# Altium schematic sheet 07-NET.SchDoc
size A4
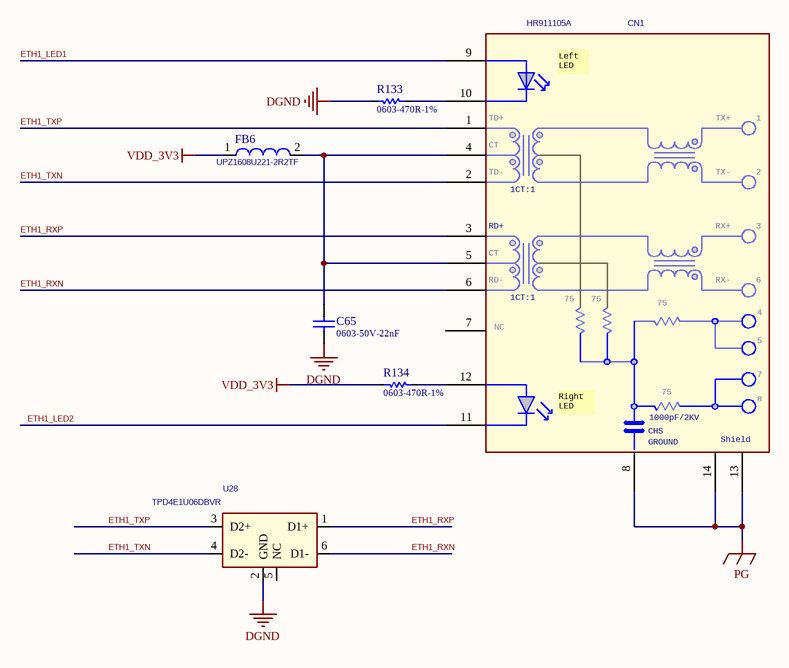
[diagram p0: 07-NET.SchDoc]

## Parts
C65  0603-50V-22nF  [0603C]
CN1  HR911105A  [HY911105A]
FB6  UPZ1608U221-2R2TF  [0603L]
R133  0603-470R-1%  [0603R]
R134  0603-470R-1%  [0603R]
U28  TPD4E1U06DBVR  [LC-SOT-23-6]

## Nets
DGND: C65.2 R133.1 U28.2(GND)
PG: CN1.8(P8) CN1.13(S1) CN1.14(S2)
VDD_3V3: FB6.1 R134.1
ETH1_LED1: CN1.9(LLED+)
ETH1_LED2: CN1.11(RLED-)
ETH1_RXN: CN1.6(P6) U28.6(D1-)
ETH1_RXP: CN1.3(P3) U28.1(D1+)
ETH1_TXN: CN1.2(P2) U28.4(D2-)
ETH1_TXP: CN1.1(P1) U28.3(D2+)
NetC65_1: C65.1 CN1.4(P4) CN1.5(P5) FB6.2
NetCN1_10: CN1.10(LLED-) R133.2
NetCN1_12: CN1.12(RLED+) R134.2

Not connected (* = marked no-connect by the designer): CN1 7(P7); U28 5(NC)

## Notes on the sheet
- (in symbol HR911105A) Left / LED; TD+; TX+; CT; TD-; TX-; 1CT:1; RD+; RX+; RD-; RX-; 75; NC; Right / LED; 1000pF/2KV; CHS; GROUND; Shield

## Library data of the parts
C65 = Cap: Capacitor; Value: 10nF; Published: 8-Jun-2000; Revision: July-2002: Re-released for DXP Platform.; Publisher: Altium Limited
CN1 = HR911105A: Connector,RJ45 Jack with integrated magnetics and leds,Right Angle,10/100M, bottom contact,white,DIP; Manufacturer: HanRun; Myir P/N: 2111800001; Part Type: Connector; Manufacturer P/N: HR911105A; Reserve Value: HR911105A; Datasheet: HR911105A.pdf
FB6 = FER_BEAD: CLASS: DISCRETE
R133 R134 = Res1: Resistor; Value: 1K; Published: 8-Jun-2000; LatestRevisionDate: 17-Jul-2002; LatestRevisionNote: Re-released for DXP Platform.; PackageReference: AXIAL-0.3; Publisher: Altium Limited
U28 = TPD4E1U06DBVR: IC,ESD Suppressor Diode Arrays ±15KV 6-Pin SOT-23; Manufacturer: TI; Myir P/N: 2011400006; Part Type: IC; Manufacturer P/N: TPD4E1U06DBVR; Reserve Value: TPD4E1U06DBVR